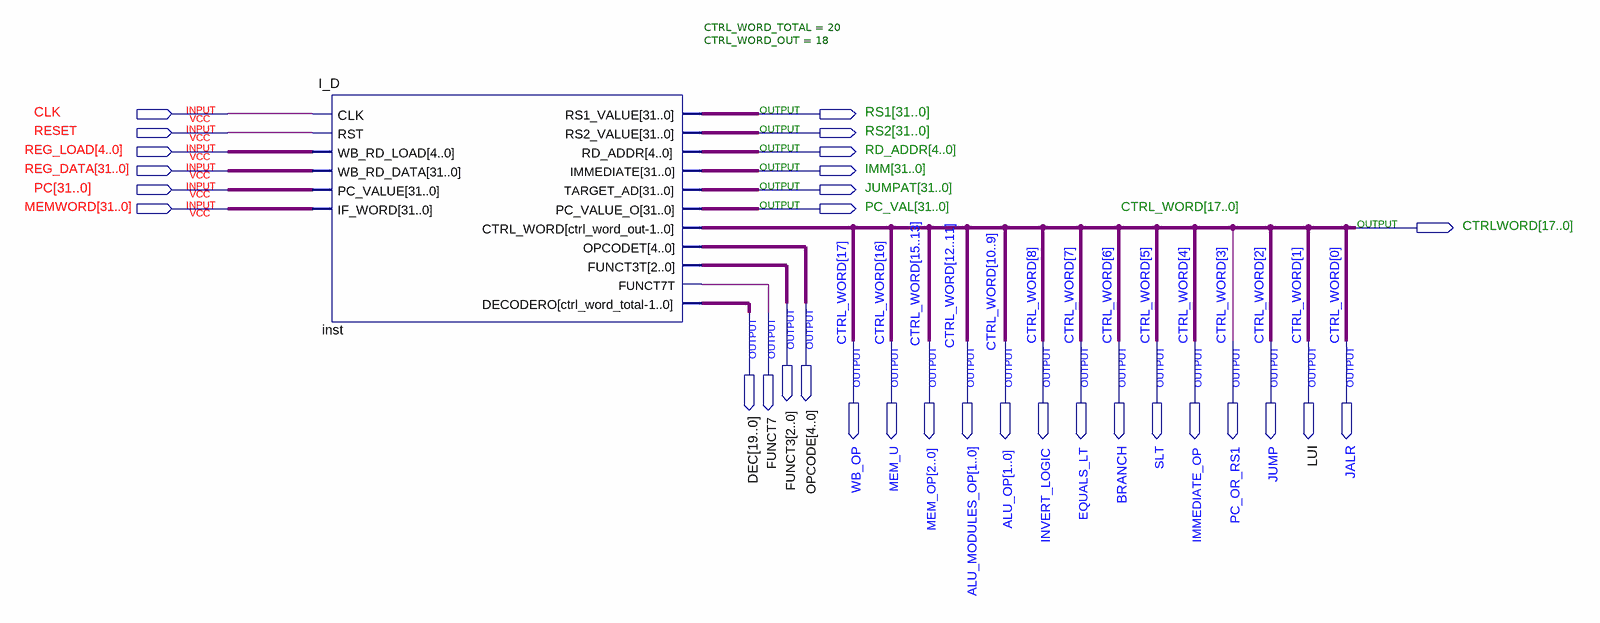
[diagram p0: schematic sheet]
// Quartus schematic I_DTEST.bdf as structural Verilog: 1 symbols, 31 pins
module I_DTEST (
  input  CLK,
  input  RESET,
  input  [4:0] REG_LOAD,
  input  [31:0] REG_DATA,
  input  [31:0] PC,
  input  [31:0] MEMWORD,
  output [31:0] RS1,
  output [31:0] RS2,
  output [4:0] RD_ADDR,
  output [31:0] IMM,
  output [31:0] JUMPAT,
  output [31:0] PC_VAL,
  output [17:0] CTRLWORD,
  output [2:0] FUNCT3,
  output [4:0] OPCODE,
  output [19:0] DEC,
  output FUNCT7,
  output WB_OP,
  output MEM_U,
  output [2:0] MEM_OP,
  output [1:0] ALU_MODULES_OP,
  output [1:0] ALU_OP,
  output INVERT_LOGIC,
  output EQUALS_LT,
  output BRANCH,
  output SLT,
  output IMMEDIATE_OP,
  output PC_OR_RS1,
  output JUMP,
  output LUI,
  output JALR
);

  I_D #(.CTRL_WORD_TOTAL(20), .CTRL_WORD_OUT(18)) inst (
    .CLK(CLK), .RST(RESET), .WB_RD_LOAD(REG_LOAD), .WB_RD_DATA(REG_DATA), .PC_VALUE(PC), .IF_WORD(MEMWORD),
    .RS1_VALUE(RS1), .RS2_VALUE(RS2), .RD_ADDR(RD_ADDR), .IMMEDIATE(IMM), .TARGET_AD(JUMPAT),
    .PC_VALUE_O(PC_VAL),
    .CTRL_WORD({CTRLWORD[17:13], ALU_MODULES_OP, ALU_OP, CTRLWORD[8:7], BRANCH, CTRLWORD[5:0]}),
    .OPCODET(OPCODE), .FUNCT3T(FUNCT3), .FUNCT7T(FUNCT7), .DECODERO(DEC));

  assign {CTRLWORD[12:9], CTRLWORD[6]} = {ALU_MODULES_OP, ALU_OP, BRANCH};
  assign EQUALS_LT = CTRLWORD[7];
  assign IMMEDIATE_OP = CTRLWORD[4];
  assign INVERT_LOGIC = CTRLWORD[8];
  assign JALR = CTRLWORD[0];
  assign JUMP = CTRLWORD[2];
  assign LUI = CTRLWORD[1];
  assign MEM_OP = CTRLWORD[15:13];
  assign MEM_U = CTRLWORD[16];
  assign PC_OR_RS1 = CTRLWORD[3];
  assign SLT = CTRLWORD[5];
  assign WB_OP = CTRLWORD[17];

  // Other names for the same wires on the sheet: CTRL_WORD[17:0] = {CTRLWORD[17:13], ALU_MODULES_OP, ALU_OP, CTRLWORD[8:7], BRANCH, CTRLWORD[5:0]}
endmodule
